# Altium schematic sheet MCU.SchDoc
size A4; SheetNumber: 3; SheetTotal: 5
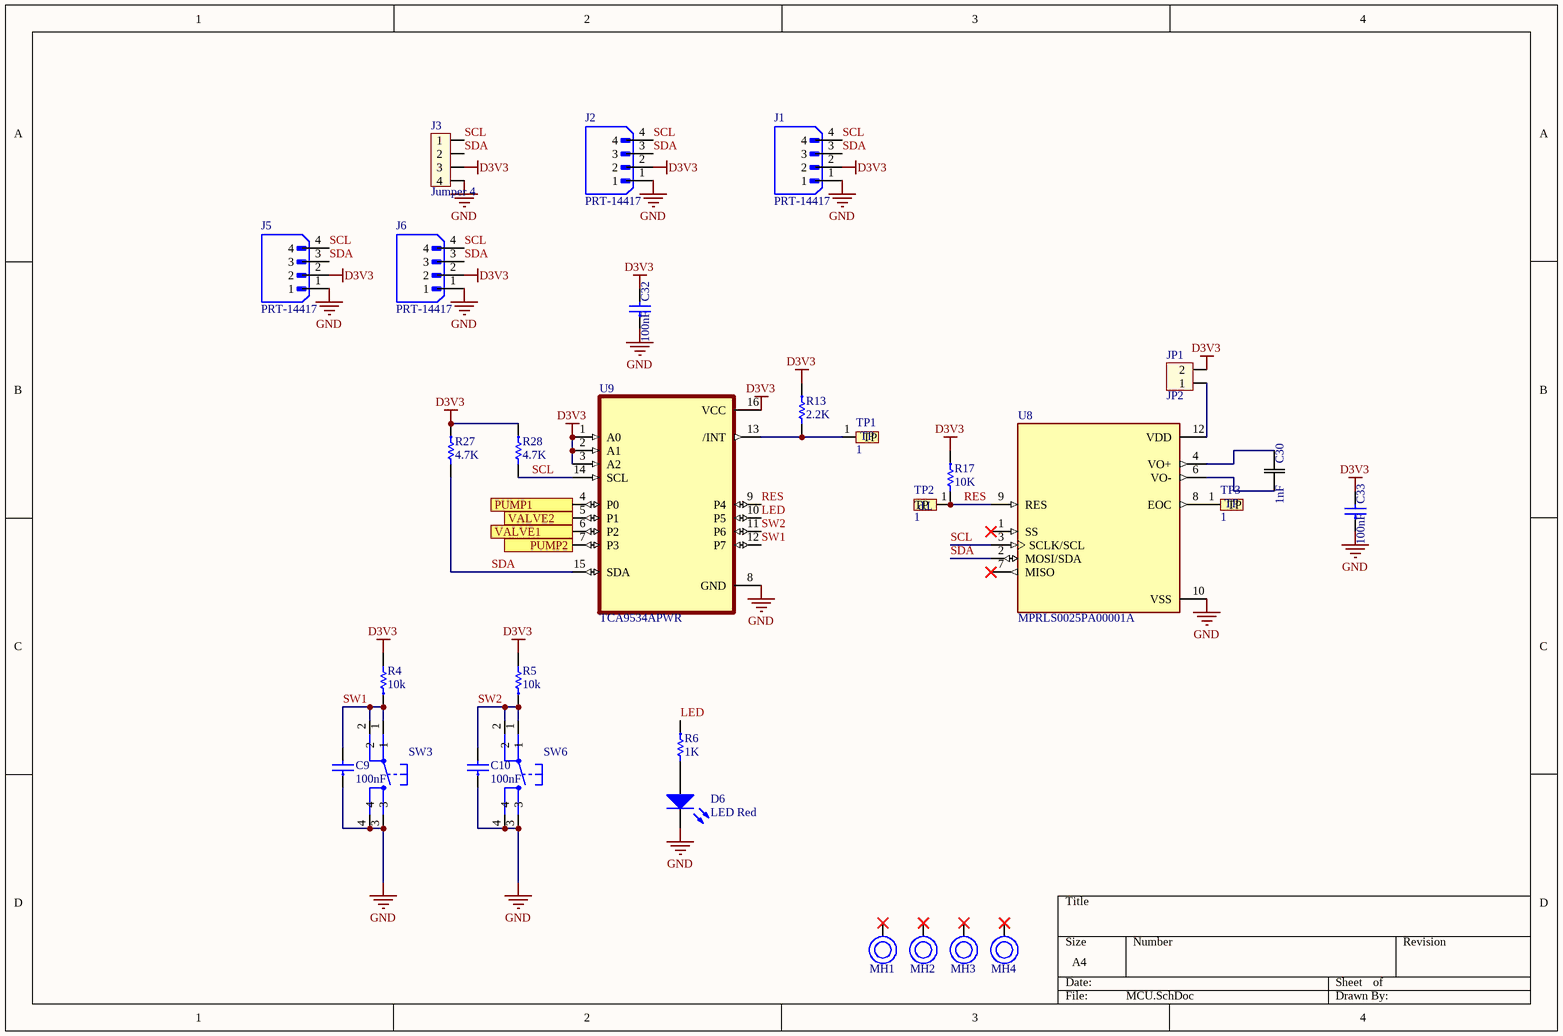
[diagram p0: MCU.SchDoc]

## Parts
C9  100nF  [C0603]
C10  100nF  [C0603]
C30  1nF  [CAP_GCJ18_1p8X0p9X0p9_MUR]
C32  100nF  [C0603]
C33  100nF  [C0603]
D6  LED Red  [LED0603-R]
J1  PRT-14417  [SPARKFUN_PRT-14417]
J2  PRT-14417  [SPARKFUN_PRT-14417]
J3  Jumper 4  [JP4]
J5  PRT-14417  [SPARKFUN_PRT-14417]
J6  PRT-14417  [SPARKFUN_PRT-14417]
JP1  JP2  [JP2-CLOSED]
MH1  MOUNTING HOLE  [M3]  (value not drawn)
MH2  MOUNTING HOLE  [M3]  (value not drawn)
MH3  MOUNTING HOLE  [M3]  (value not drawn)
MH4  MOUNTING HOLE  [M3]  (value not drawn)
R4  10k  [R0603]
R5  10k  [R0603]
R6  1K  [R0603]
R13  2.2K  [R0603]
R17  10K  [R0603]
R27  4.7K  [R0603]
R28  4.7K  [R0603]
SW3  SW2  [SWITCH]  (value not drawn)
SW6  SW2  [SWITCH]  (value not drawn)
TP1  1  [TP]
TP2  1  [TP]
TP3  1  [TP]
U8  MPRLS0025PA00001A  [XDCR_MPRLS0025PA00001A]
U9  TCA9534APWR  [SOP65P640X120-16N]

## Ports
PUMP1 (out), PUMP2 (out), VALVE1 (out), VALVE2 (out)

## Nets
D3V3: C32.2 C33.2 J1.2 J2.2 J3.3 J5.2 J6.2 JP1.2 R4.2 R5.2 R13.1 R17.1 R27.1 R28.1 U9.1(A0) U9.2(A1) U9.3(A2) U9.16(VCC)
GND: C9.1 C10.1 C32.1 C33.1 D6.2(K) J1.1 J2.1 J3.4 J5.1 J6.1 SW3.3 SW3.4 SW6.3 SW6.4 U8.10(VSS) U9.8(GND)
LED: R6.1 U9.10(P5)
PUMP1: U9.4(P0) ; port PUMP1
PUMP2: U9.7(P3) ; port PUMP2
RES: R17.2 TP2.1(TP) U8.9(RES) U9.9(P4)
SCL: J1.4 J2.4 J3.1 J5.4 J6.4 R28.2 U8.3(SCLK/SCL) U9.14(SCL)
SDA: J1.3 J2.3 J3.2 J5.3 J6.3 R27.2 U8.2(MOSI/SDA) U9.15(SDA)
SW1: C9.2 R4.1 SW3.1 SW3.2 U9.12(P7)
SW2: C10.2 R5.1 SW6.1 SW6.2 U9.11(P6)
VALVE1: U9.6(P2) ; port VALVE1
VALVE2: U9.5(P1) ; port VALVE2
NetC30_1: C30.1 U8.6(VO-)
NetC30_2: C30.2 U8.4(VO+)
NetD6_1: D6.1(A) R6.2
NetJP1_1: JP1.1 U8.12(VDD)
NetR13_2: R13.2 TP1.1(TP) U9.13(/INT)
NetTP3_1: TP3.1(TP) U8.8(EOC)

Not connected (* = marked no-connect by the designer): MH1 1(GND)*; MH2 1(GND)*; MH3 1(GND)*; MH4 1(GND)*; U8 1(SS)* 7(MISO)*

## Library data of the parts
C9 C10 C32 C33 = CAPCER0001 100nF 10% 50V X7R 0603 SMD: CAP CER 100nF 10% 50V X7R 0603 SMD; LINE: SMT; TYPE: EP; UNIT: PCS; TMG CODE: None; CERTIFICATION: NA; CLASS: B; MOUNT: SMD; TMG PN: CAPCER0001; ComponentLink1Description: Datasheet; ComponentLink1URL: https://datasheet.lcsc.com/lcsc/1811021431_Samsung-Electro-Mechanics-CL10B104KB8NNNC_C1591.pdf; Footprint: 0603
C30 = GCJ188R71H102KA01D: No Description Available; Manufacturer_Name: Murata; Type: Ceramic Capacitors; Copyright: Copyright (C) 2026 Ultra Librarian. All rights reserved.; Manufacturer_Part_Number: GCJ188R71H102KA01D
D6 = LTST-C190KRKT: Lite-On LED Red 0603; Supplier Part Number 1: 160-1436-1-ND; Supplier 1: Digi-Key; Supplier Part Number 2: FL1413; Value: LED Red
J1 J2 J5 J6 = PRT-14417: QWIIC JST CONNECTOR - SMD 4-PIN; MF: SparkFun Electronics; SnapEDA_Link: https://www.snapeda.com/parts/PRT-14417/SparkFun+Electronics/view-part/?ref=snap; Package: None; Value: *; MP: PRT-14417; Check_prices: https://www.snapeda.com/parts/PRT-14417/SparkFun+Electronics/view-part/?ref=eda
J3 = JP4: Jumper 3; Value: J3
JP1 = Con2: jumper 2.0 B; Value: Connector 2
MH1-MH4 = MH
R4-R6 R13 R17 R27 R28 = RESCHP0428 8K4 1% 0603 SMD: RES CHP 8K4 1% 1/10W 0603 SMD; LINE: SMT; UNIT: PCS; TMG CODE: None; CERTIFICATION: NA; CLASS: B; MOUNT: SMD; TYPE: EP; ComponentLink1Description: Datasheet; ComponentLink1URL: https://datasheet.lcsc.com/lcsc/2304140030_YAGEO-RT0603FRD07100RL_C160603.pdf
SW3 SW6 = SW2: Switch button 4 pin
TP1-TP3 = TP: CONNECT 1
U8 = MPRLS0025PA00001A: Pressure Sensor 25PSI _172.37kPa_ Absolute Male - 0.1 _2.5mm_ Tube 24 b 12-SMD Module; MF: Honeywell Sensing; MP: MPRLS0025PA00001A; SnapEDA_Link: https://www.snapeda.com/parts/MPRLS0025PA00001A/Honeywell%20Sensing%20and%20Productivity%20Solutions/view-part/2772767/?ref=snap; Digi-Key_Part_Number: 480-7098-1-ND; Package: SMD-10 Honeywell; Value: *
U9 = TCA9534APWR: 8-bit 1.65- to 5.5-V I2C/SMBus I/O expander with interrupt, & config registers; MF: Texas Instruments; SnapEDA_Link: https://www.snapeda.com/parts/TCA9534APWR/Texas+Instruments/view-part/?ref=snap; Package: TSSOP-16 Texas Instruments; Value: *; MP: TCA9534APWR; Check_prices: https://www.snapeda.com/parts/TCA9534APWR/Texas+Instruments/view-part/?ref=eda